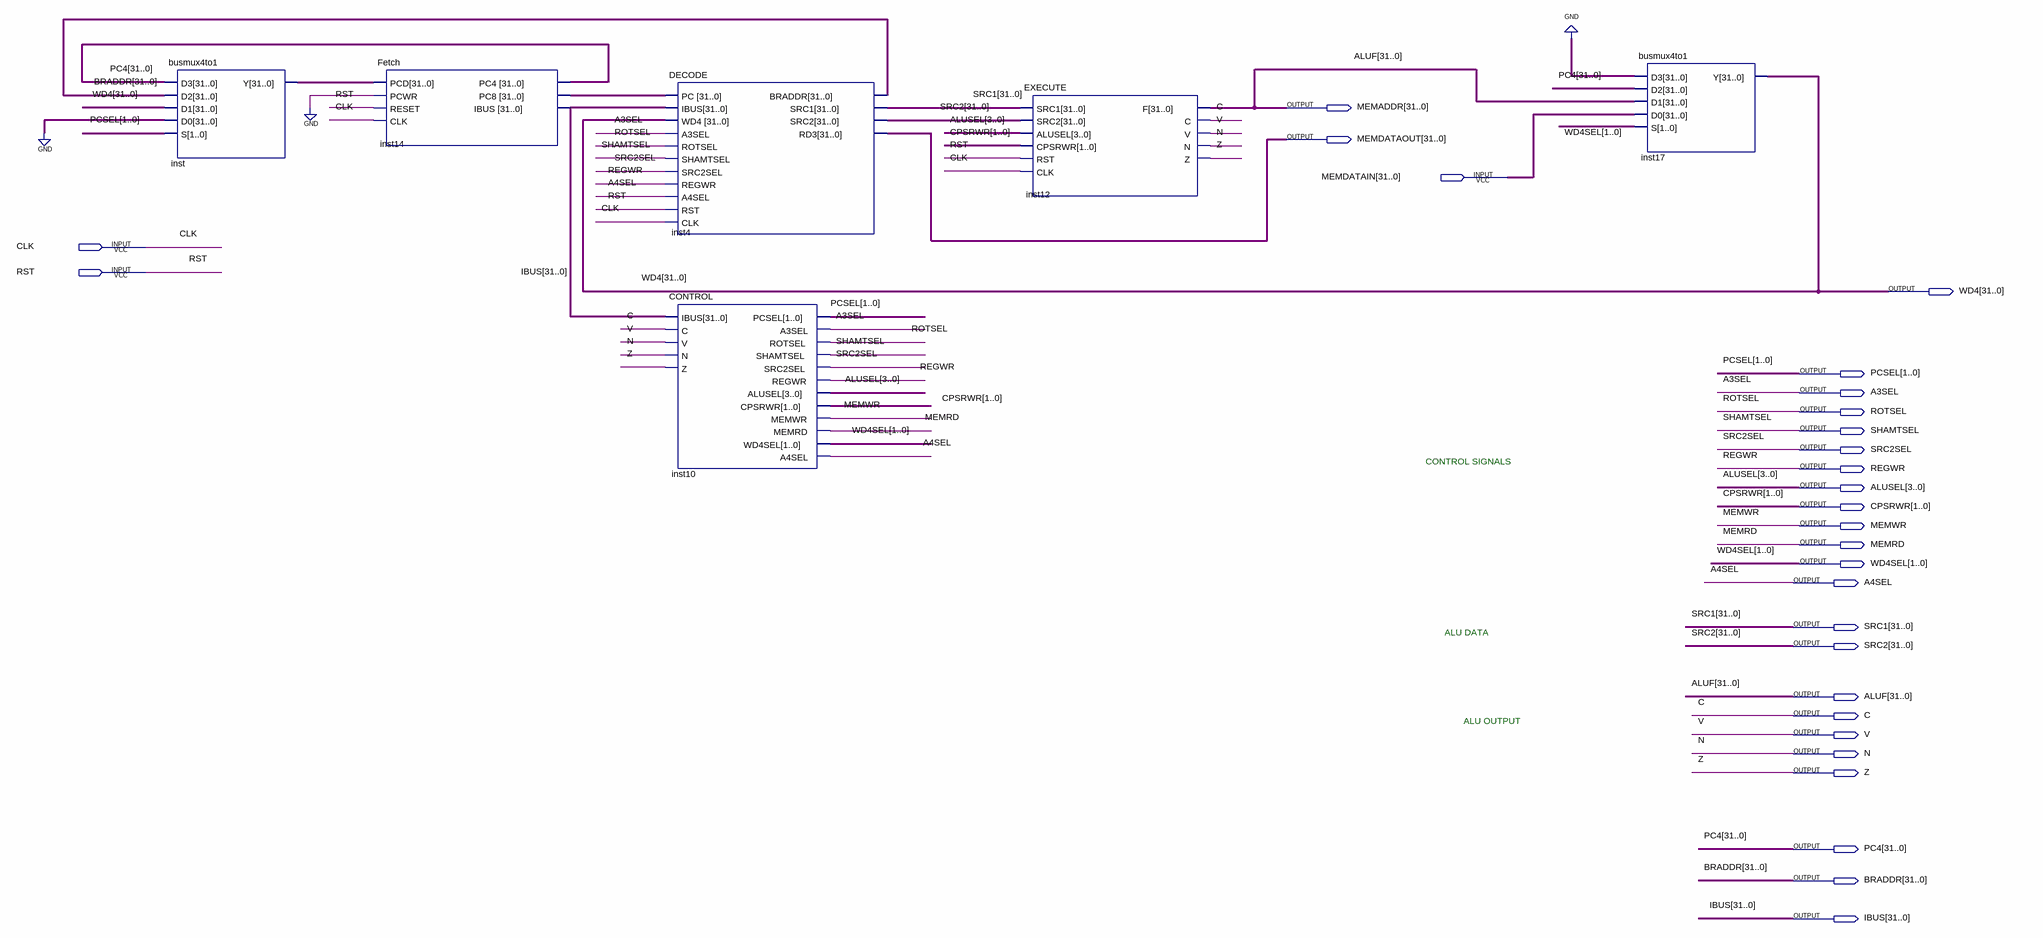
[diagram p0: schematic sheet]
// Quartus schematic TOPLEVELDESIGN.bdf as structural Verilog: 6 symbols, 28 pins
module TOPLEVELDESIGN (
  input  [31:0] MEMDATAIN,
  input  CLK,
  input  RST,
  output [31:0] MEMADDR,
  output [31:0] MEMDATAOUT,
  output [31:0] WD4,
  output [1:0] PCSEL,
  output A3SEL,
  output ROTSEL,
  output SHAMTSEL,
  output SRC2SEL,
  output REGWR,
  output [3:0] ALUSEL,
  output [1:0] CPSRWR,
  output MEMWR,
  output MEMRD,
  output [1:0] WD4SEL,
  output A4SEL,
  output [31:0] SRC1,
  output [31:0] SRC2,
  output [31:0] ALUF,
  output C,
  output V,
  output N,
  output Z,
  output [31:0] PC4,
  output [31:0] BRADDR,
  output [31:0] IBUS
);

  wire [31:0] inst14_pc8, inst_y;

  busmux4to1 inst (.D3(PC4), .D2(BRADDR), .D1(WD4), .D0({32{1'b0}}), .S(PCSEL), .Y(inst_y));
  Fetch inst14 (.PCD(inst_y), .PCWR(1'b0), .RESET(RST), .CLK(CLK), .PC4(PC4), .PC8(inst14_pc8), .IBUS(IBUS));
  DECODE inst4 (
    .PC(inst14_pc8), .IBUS(IBUS), .WD4(WD4), .A3SEL(A3SEL), .ROTSEL(ROTSEL), .SHAMTSEL(SHAMTSEL),
    .SRC2SEL(SRC2SEL), .REGWR(REGWR), .A4SEL(A4SEL), .RST(RST), .CLK(CLK), .BRADDR(BRADDR), .SRC1(SRC1),
    .SRC2(SRC2), .RD3(MEMDATAOUT));
  CONTROL inst10 (
    .IBUS(IBUS), .C(C), .V(V), .N(N), .Z(Z), .PCSEL(PCSEL), .A3SEL(A3SEL), .ROTSEL(ROTSEL),
    .SHAMTSEL(SHAMTSEL), .SRC2SEL(SRC2SEL), .REGWR(REGWR), .ALUSEL(ALUSEL), .CPSRWR(CPSRWR), .MEMWR(MEMWR),
    .MEMRD(MEMRD), .WD4SEL(WD4SEL), .A4SEL(A4SEL));
  EXECUTE inst12 (
    .SRC1(SRC1), .SRC2(SRC2), .ALUSEL(ALUSEL), .CPSRWR(CPSRWR), .RST(RST), .CLK(CLK), .F(ALUF), .C(C), .V(V),
    .N(N), .Z(Z));
  busmux4to1 inst17 (.D3({32{1'b0}}), .D2(PC4), .D1(ALUF), .D0(MEMDATAIN), .S(WD4SEL), .Y(WD4));

  assign MEMADDR = ALUF;

  // Notes on the sheet:
  //   CONTROL SIGNALS
  //   ALU DATA
  //   ALU OUTPUT
endmodule
